# Altium schematic sheet 07-寻迹传感器模块--原理图.SchDoc
size A4
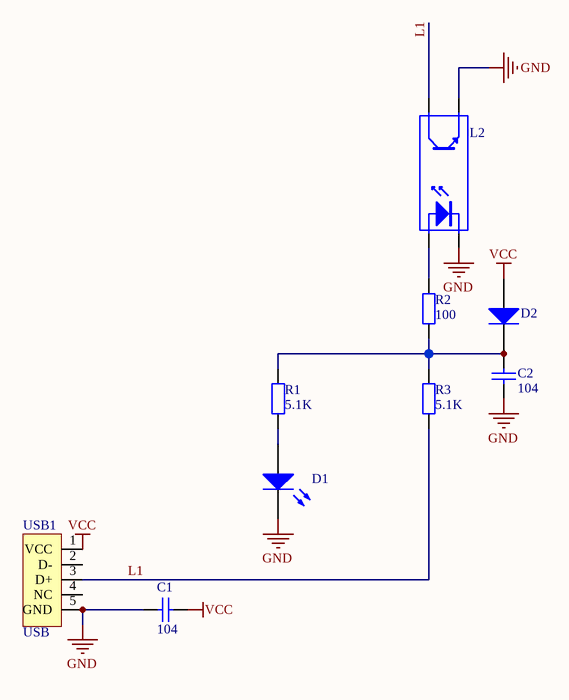
[diagram p0: 07-寻迹传感器模块--原理图.SchDoc]

## Parts
C1  value 104  [0805]  (hidden comment: Cap)
C2  value 104  [0805]  (hidden comment: Cap)
D1  LED0  [0805]  (value not drawn)
D2  Diode  [0805]  (value not drawn)
L2  Optoisolator1  [Red]  (value not drawn)
R1  value 5.1K  [0805]  (hidden comment: res2)
R2  value 100  [0805]  (hidden comment: res2)
R3  value 5.1K  [0805]  (hidden comment: res2)
USB1  USB  [USB/SM0.8-6H5]

## Nets
GND: C1.2 C2.2 D1.2(K) L2.2(K) L2.3(E) USB1.5(GND)
VCC: C1.1 D2.1(A) USB1.1(VCC)
L1: L2.4(C) R3.2 USB1.3(D+)
NetC2_1: C2.1 D2.2(K) R1.1 R2.2 R3.1
NetD1_1: D1.1(A) R1.2
NetL2_1: L2.1(A) R2.1

Not connected (* = marked no-connect by the designer): USB1 2(D-) 4(NC)

## Library data of the parts
C1 C2 = Cap: Capacitor; Published: 8-Jun-2000; LatestRevisionDate: 17-Jul-2002; LatestRevisionNote: Re-released for DXP Platform.; PackageReference: RAD-0.3; Publisher: Altium Limited
D1 = LED0: Typical INFRARED GaAs LED; Published: 8-Jun-2000; LatestRevisionDate: 08-Jul-2005; LatestRevisionNote: Mech Layer 1 removed.; PackageReference: LED-0; Publisher: Altium Limited
D2 = Diode: Default Diode; Published: 8-Jun-2000; LatestRevisionDate: 17-Jul-2002; LatestRevisionNote: Re-released for DXP Platform.; PackageVersion: Sep-1996; PackageReference: SMC; Publisher: Altium Limited; Code_JEDEC: DO-214-AB
L2 = Optoisolator1: 4-Pin Phototransistor Optocoupler; Published: 24-Mar-1999; LatestRevisionDate: 04-Mar-2005; LatestRevisionNote: Sch pins 3 & 4 Swapped.; DatasheetVersion: Nov-2003; PackageReference: DIP-4; Publisher: Altium Limited
R1-R3 = res2: Resistor; Published: 8-Jun-2000; LatestRevisionDate: 17-Jul-2002; LatestRevisionNote: Re-released for DXP Platform.; PackageReference: AXIAL-0.4; Publisher: Altium Limited
USB1 = USB5